# Altium schematic sheet project_15.SchDoc
size A4; SheetNumber: 1; SheetTotal: 1
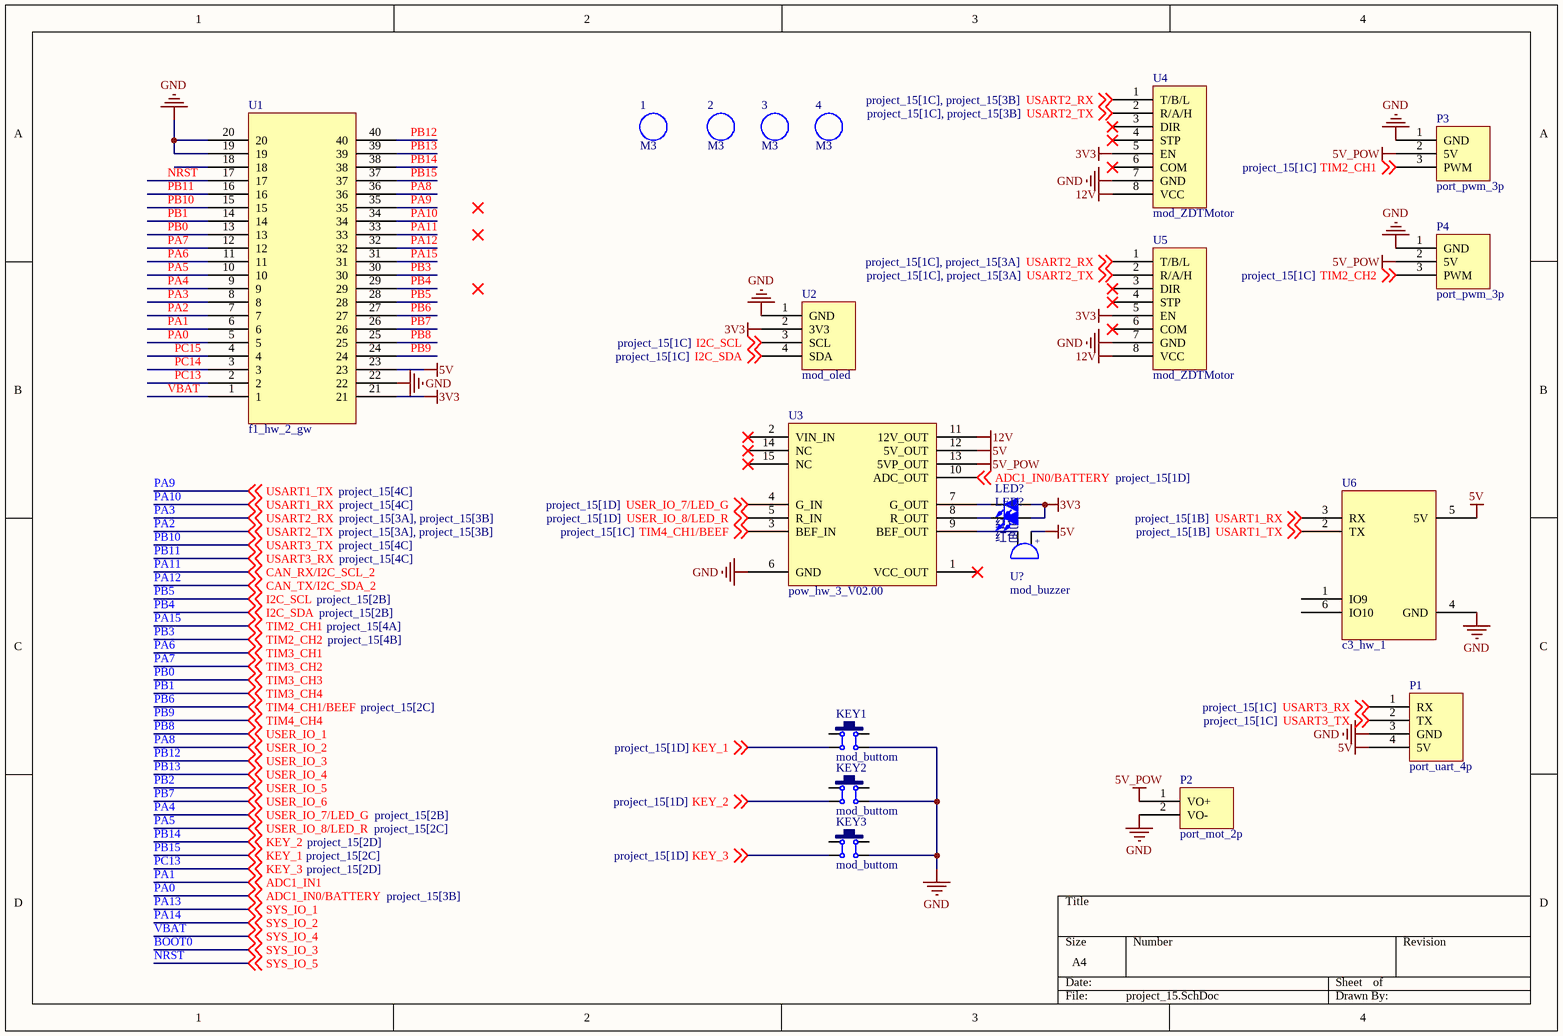
[diagram p0: project_15.SchDoc]

## Parts
(Parts that share a designator on the sheet are numbered #1, #2 ... from top to bottom, then left to right.)
1  M3  [M3 125X200]
2  M3  [M3 125X200]
3  M3  [M3 125X200]
4  M3  [M3 125X200]
KEY1  mod_buttom  [MOD_BUTTOM]
KEY2  mod_buttom  [MOD_BUTTOM]
KEY3  mod_buttom  [MOD_BUTTOM]
LED?#1  红色  [LED 3MM-B]
LED?#2  红色  [LED 3MM-B]
P1  port_uart_4p  [XH2.54_4P]
P2  port_mot_2p  [XH2.54_2P]
P3  port_pwm_3p  [XH2.54_3P]
P4  port_pwm_3p  [XH2.54_3P]
U1  f1_hw_2_gw  [F1_HW_2_GW]
U2  mod_oled  [MOD_OLED]
U3  pow_hw_3_V02.00  [POW_HW_3_2]
U4  mod_ZDTMotor  [XH2.54-LI-8P]
U5  mod_ZDTMotor  [XH2.54-LI-8P]
U6  c3_hw_1  [C3_HW_1]
U?  mod_buzzer  [MOD_BUZZER]

## Nets
3V3: LED?#1.1(A) LED?#2.1(A) U1.21 U2.2(3V3) U4.5(EN) U5.5(EN)
5V: P1.4(5V) U1.23 U3.12(5V_OUT) U6.5(5V) U?.1
5V_POW: P2.1(VO+) P3.2(5V) P4.2(5V) U3.13(5VP_OUT)
12V: U3.11(12V_OUT) U4.8(VCC) U5.8(VCC)
GND: KEY1.3 KEY2.3 KEY3.3 P1.3(GND) P2.2(VO-) P3.1(GND) P4.1(GND) U1.19 U1.20 U1.22 U2.1(GND) U3.6(GND) U4.7(GND) U5.7(GND) U6.4(GND)
NRST: U1.17 ; off-sheet SYS_IO_5  [also labelled SYS_IO_5]
PA0: U1.5 U3.10(ADC_OUT) ; off-sheet ADC1_IN0/BATTERY  [also labelled ADC1_IN0/BATTERY]
PA1: U1.6 ; off-sheet ADC1_IN1  [also labelled ADC1_IN1]
PA2: U1.7 U4.2(R/A/H) U5.2(R/A/H) ; off-sheet USART2_TX  [also labelled USART2_TX]
PA3: U1.8 U4.1(T/B/L) U5.1(T/B/L) ; off-sheet USART2_RX  [also labelled USART2_RX]
PA4: U1.9 U3.4(G_IN) ; off-sheet USER_IO_7/LED_G  [also labelled USER_IO_7/LED_G]
PA5: U1.10 U3.5(R_IN) ; off-sheet USER_IO_8/LED_R  [also labelled USER_IO_8/LED_R]
PA6: U1.11 ; off-sheet TIM3_CH1  [also labelled TIM3_CH1]
PA7: U1.12 ; off-sheet TIM3_CH2  [also labelled TIM3_CH2]
PA8: U1.36 ; off-sheet USER_IO_2  [also labelled USER_IO_2]
PA9: U1.35 U6.2(TX) ; off-sheet USART1_TX  [also labelled USART1_TX]
PA10: U1.34 U6.3(RX) ; off-sheet USART1_RX  [also labelled USART1_RX]
PA11: U1.33 ; off-sheet CAN_RX/I2C_SCL_2  [also labelled CAN_RX/I2C_SCL_2]
PA12: U1.32 ; off-sheet CAN_TX/I2C_SDA_2  [also labelled CAN_TX/I2C_SDA_2]
PA15: P3.3(PWM) U1.31 ; off-sheet TIM2_CH1  [also labelled TIM2_CH1]
PB0: U1.13 ; off-sheet TIM3_CH3  [also labelled TIM3_CH3]
PB1: U1.14 ; off-sheet TIM3_CH4  [also labelled TIM3_CH4]
PB3: P4.3(PWM) U1.30 ; off-sheet TIM2_CH2  [also labelled TIM2_CH2]
PB4: U1.29 U2.4(SDA) ; off-sheet I2C_SDA  [also labelled I2C_SDA]
PB5: U1.28 U2.3(SCL) ; off-sheet I2C_SCL  [also labelled I2C_SCL]
PB6: U1.27 U3.3(BEF_IN) ; off-sheet TIM4_CH1/BEEF  [also labelled TIM4_CH1/BEEF]
PB7: U1.26 ; off-sheet USER_IO_6  [also labelled USER_IO_6]
PB8: U1.25 ; off-sheet USER_IO_1  [also labelled USER_IO_1]
PB9: U1.24 ; off-sheet TIM4_CH4  [also labelled TIM4_CH4]
PB10: P1.2(TX) U1.15 ; off-sheet USART3_TX  [also labelled USART3_TX]
PB11: P1.1(RX) U1.16 ; off-sheet USART3_RX  [also labelled USART3_RX]
PB12: U1.40 ; off-sheet USER_IO_3  [also labelled USER_IO_3]
PB13: U1.39 ; off-sheet USER_IO_4  [also labelled USER_IO_4]
PB14: KEY2.4 U1.38 ; off-sheet KEY_2  [also labelled KEY_2]
PB15: KEY1.4 U1.37 ; off-sheet KEY_1  [also labelled KEY_1]
PC13: KEY3.4 U1.2 ; off-sheet KEY_3  [also labelled KEY_3]
PC14: U1.3
PC15: U1.4
VBAT: U1.1 ; off-sheet SYS_IO_4  [also labelled SYS_IO_4]
NetLED?#1_2: LED?#1.2(K) U3.7(G_OUT)
NetLED?#2_2: LED?#2.2(K) U3.8(R_OUT)
NetU3_9: U3.9(BEF_OUT) U?.2

Not connected (* = marked no-connect by the designer): KEY1 1 2; KEY2 1 2; KEY3 1 2; U1 18; U3 1(VCC_OUT)* 2(VIN_IN)* 14(NC)* 15(NC)*; U4 3(DIR)* 4(STP)* 6(COM)*; U5 3(DIR)* 4(STP)* 6(COM)*; U6 1(IO9) 6(IO10)

## Notes on the sheet
- (in symbol mod_buzzer) +

## Library data of the parts
1-4 = prot_m3: m3铜柱孔; BOM名称: 铜柱孔; 版权归属: 源创客; 学习资源: www.ooocke.com
KEY1-KEY3 = mod_buttom: 6*6*4.3按键
LED?#1 LED?#2 = mod_LED: 插件LED; 版权归属: 源创客; BOM名称: 插件LED; 学习资源: www.ooocke.com
P1 = port_uart_4p: 串口接口/SPP蓝牙模块 / XH2.54弯排针4p/4p排母
P2 = port_mot_2p: 开环直流电机接口 / XH2.54弯排针2p
P3 P4 = port_pwm_3p: 舵机接口 / XH2.54弯排针3p
U2 = mod_oled: oled模块 / 4p排母
U3 = pow_hw_3_V02.00: 两路降压电源模块一路通用电源模块
U4 U5 = mod_ZDTMotor: 闭环步进,10-29V
U6 = c3_hw_1: ESP32C3蓝牙模块 / 6p排母
U? = mod_buzzer: 有源蜂鸣器